# Altium schematic sheet S7CAS-PLEIADES-CARTE-MERE_P07_CLOCK.SchDoc
size Tabloid; DocumentNumber: 10; SheetNumber: 10; SheetTotal: 16; Sheet_Name: CLOCK; Size: 11x17
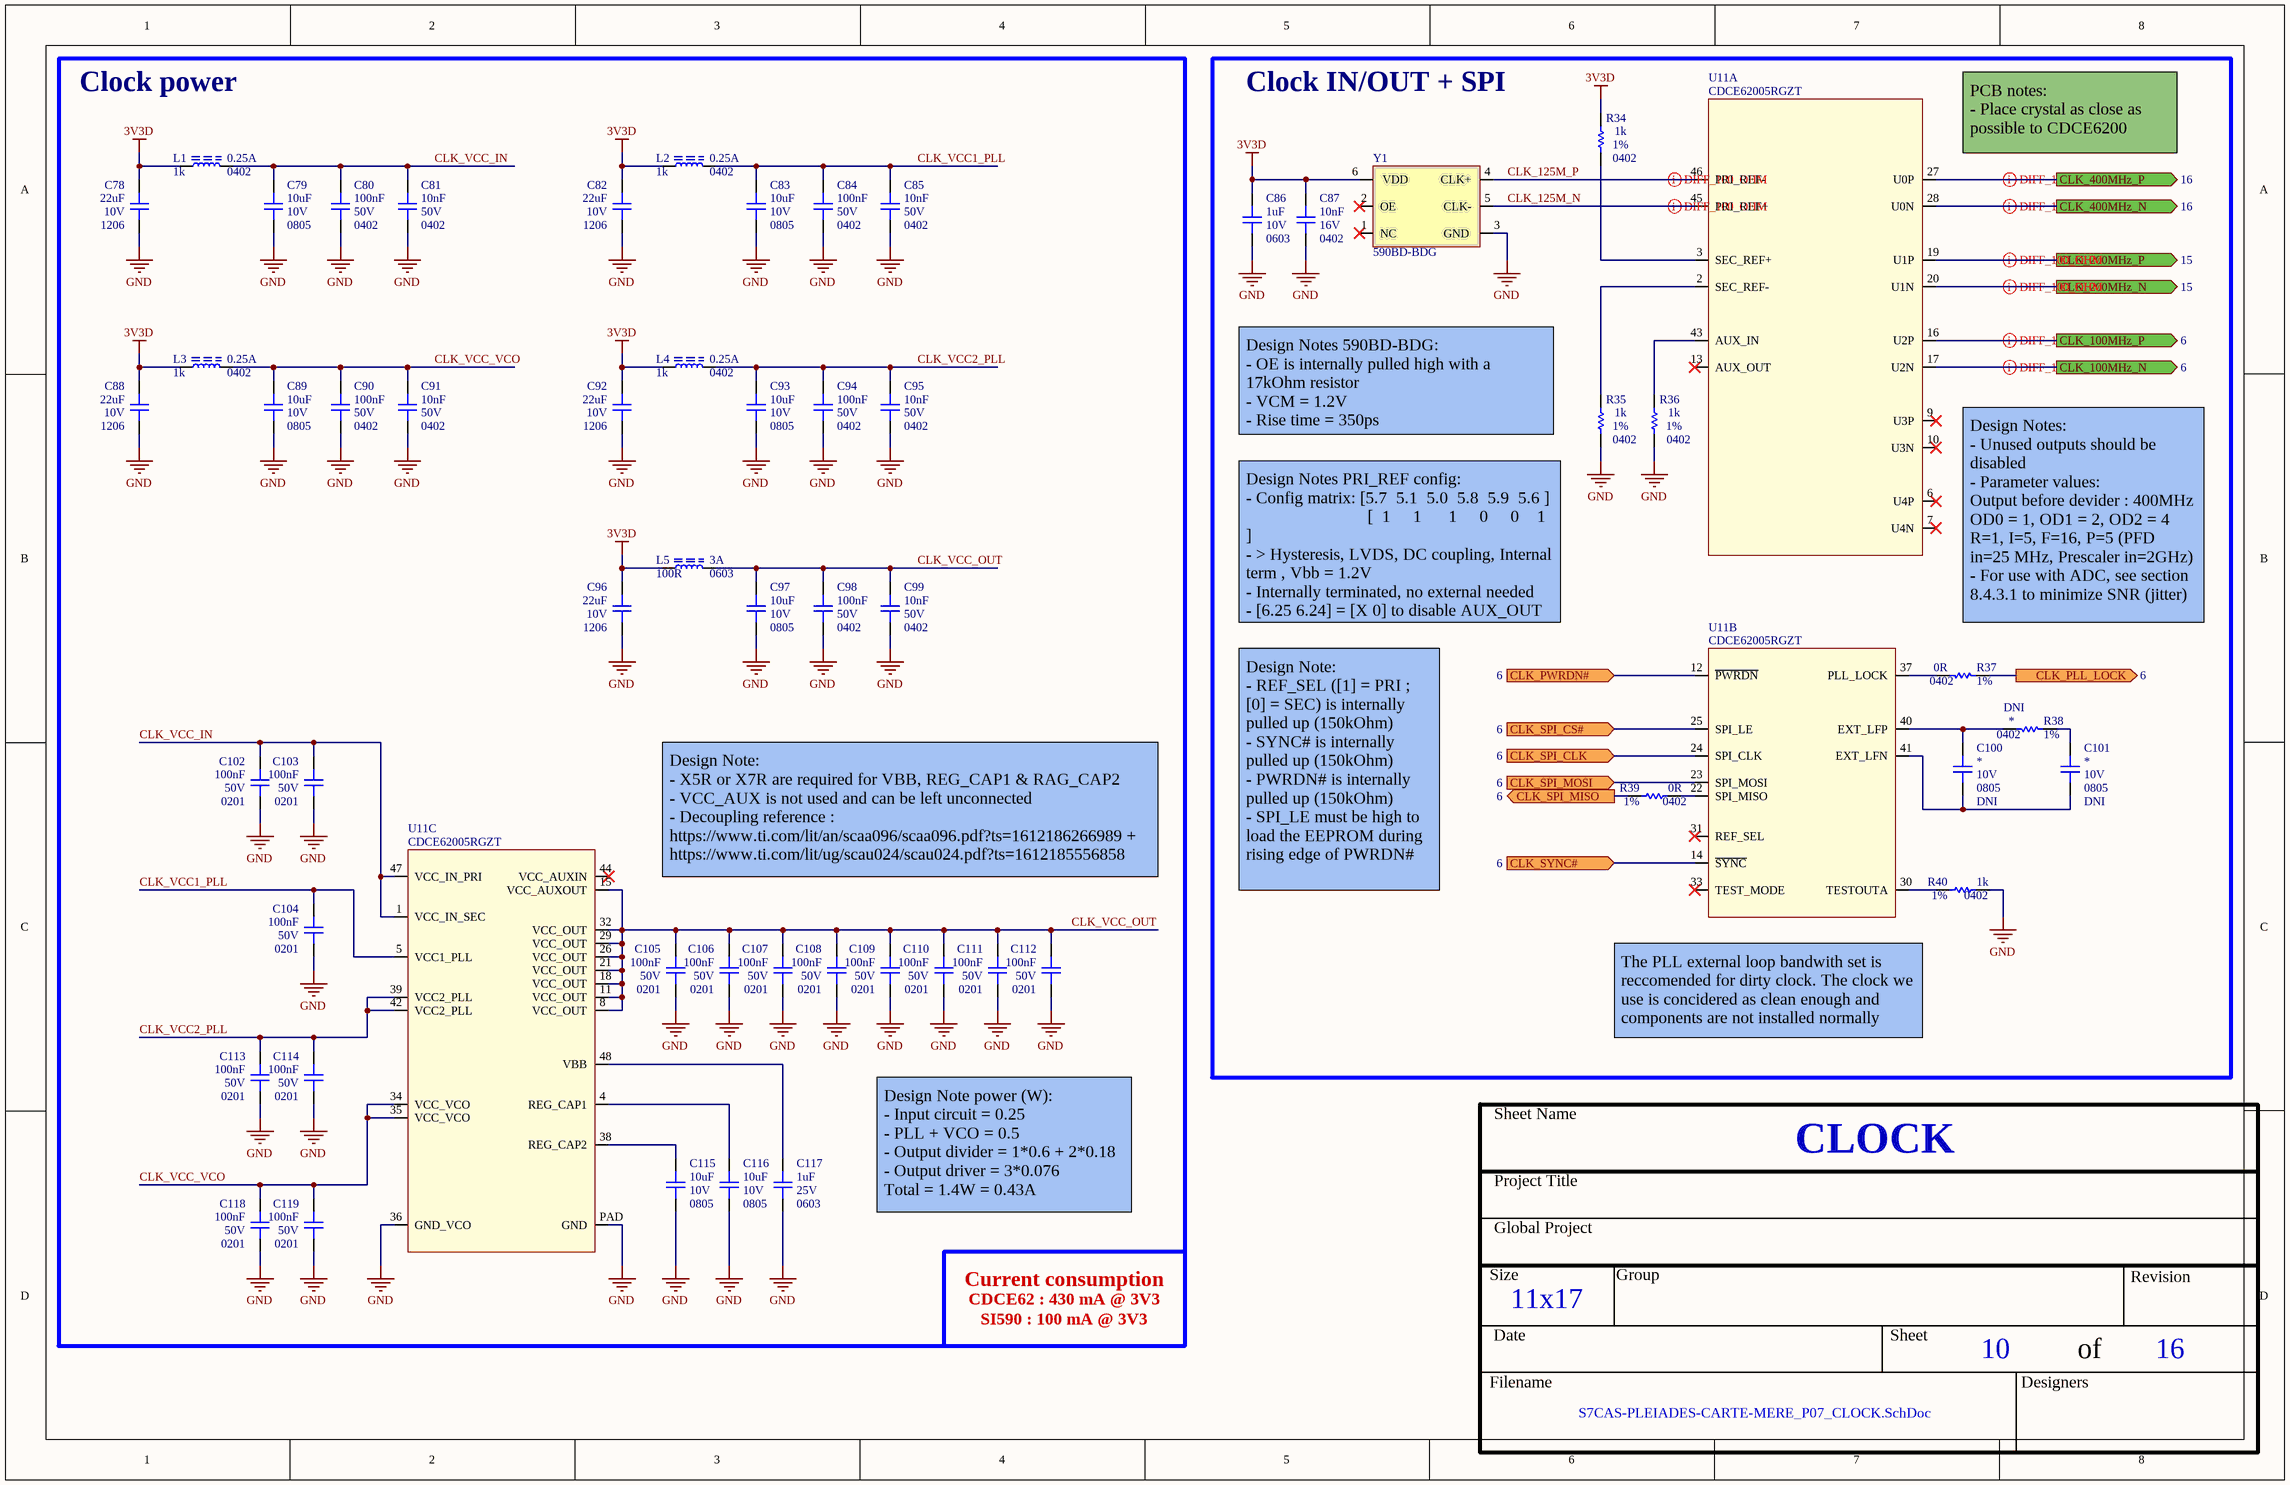
[diagram p0: S7CAS-PLEIADES-CARTE-MERE_P07_CLOCK.SchDoc]

## Parts
C78  value 22uF  Voltage: 10V  Package: 1206  [CAP_1206]  (hidden comment: CAP - 1206)
C79  value 10uF  Voltage: 10V  Package: 0805  [CAP_0805]  (hidden comment: CAP - 0805)
C80  value 100nF  Voltage: 50V  Package: 0402  [CAP_0402]  (hidden comment: CAP - 0402)
C81  value 10nF  Voltage: 50V  Package: 0402  [CAP_0402]  (hidden comment: CAP - 0402)
C82  value 22uF  Voltage: 10V  Package: 1206  [CAP_1206]  (hidden comment: CAP - 1206)
C83  value 10uF  Voltage: 10V  Package: 0805  [CAP_0805]  (hidden comment: CAP - 0805)
C84  value 100nF  Voltage: 50V  Package: 0402  [CAP_0402]  (hidden comment: CAP - 0402)
C85  value 10nF  Voltage: 50V  Package: 0402  [CAP_0402]  (hidden comment: CAP - 0402)
C86  value 1uF  Voltage: 10V  Package: 0603  [CAP_0603]  (hidden comment: CAP - 0603)
C87  value 10nF  Voltage: 16V  Package: 0402  [CAP_0402]  (hidden comment: CAP - 0402)
C88  value 22uF  Voltage: 10V  Package: 1206  [CAP_1206]  (hidden comment: CAP - 1206)
C89  value 10uF  Voltage: 10V  Package: 0805  [CAP_0805]  (hidden comment: CAP - 0805)
C90  value 100nF  Voltage: 50V  Package: 0402  [CAP_0402]  (hidden comment: CAP - 0402)
C91  value 10nF  Voltage: 50V  Package: 0402  [CAP_0402]  (hidden comment: CAP - 0402)
C92  value 22uF  Voltage: 10V  Package: 1206  [CAP_1206]  (hidden comment: CAP - 1206)
C93  value 10uF  Voltage: 10V  Package: 0805  [CAP_0805]  (hidden comment: CAP - 0805)
C94  value 100nF  Voltage: 50V  Package: 0402  [CAP_0402]  (hidden comment: CAP - 0402)
C95  value 10nF  Voltage: 50V  Package: 0402  [CAP_0402]  (hidden comment: CAP - 0402)
C96  value 22uF  Voltage: 10V  Package: 1206  [CAP_1206]  (hidden comment: CAP - 1206)
C97  value 10uF  Voltage: 10V  Package: 0805  [CAP_0805]  (hidden comment: CAP - 0805)
C98  value 100nF  Voltage: 50V  Package: 0402  [CAP_0402]  (hidden comment: CAP - 0402)
C99  value 10nF  Voltage: 50V  Package: 0402  [CAP_0402]  (hidden comment: CAP - 0402)
C100  Voltage: 10V  NI: DNI  Package: 0805  [CAP_0805]  (hidden comment: CAP - 0805)
C101  Voltage: 10V  NI: DNI  Package: 0805  [CAP_0805]  (hidden comment: CAP - 0805)
C102  value 100nF  Voltage: 50V  Package: 0201  [CAP_0201]  (hidden comment: CAP - 0201)
C103  value 100nF  Voltage: 50V  Package: 0201  [CAP_0201]  (hidden comment: CAP - 0201)
C104  value 100nF  Voltage: 50V  Package: 0201  [CAP_0201]  (hidden comment: CAP - 0201)
C105  value 100nF  Voltage: 50V  Package: 0201  [CAP_0201]  (hidden comment: CAP - 0201)
C106  value 100nF  Voltage: 50V  Package: 0201  [CAP_0201]  (hidden comment: CAP - 0201)
C107  value 100nF  Voltage: 50V  Package: 0201  [CAP_0201]  (hidden comment: CAP - 0201)
C108  value 100nF  Voltage: 50V  Package: 0201  [CAP_0201]  (hidden comment: CAP - 0201)
C109  value 100nF  Voltage: 50V  Package: 0201  [CAP_0201]  (hidden comment: CAP - 0201)
C110  value 100nF  Voltage: 50V  Package: 0201  [CAP_0201]  (hidden comment: CAP - 0201)
C111  value 100nF  Voltage: 50V  Package: 0201  [CAP_0201]  (hidden comment: CAP - 0201)
C112  value 100nF  Voltage: 50V  Package: 0201  [CAP_0201]  (hidden comment: CAP - 0201)
C113  value 100nF  Voltage: 50V  Package: 0201  [CAP_0201]  (hidden comment: CAP - 0201)
C114  value 100nF  Voltage: 50V  Package: 0201  [CAP_0201]  (hidden comment: CAP - 0201)
C115  value 10uF  Voltage: 10V  Package: 0805  [CAP_0805]  (hidden comment: CAP - 0805)
C116  value 10uF  Voltage: 10V  Package: 0805  [CAP_0805]  (hidden comment: CAP - 0805)
C117  value 1uF  Voltage: 25V  Package: 0603  [CAP_0603]  (hidden comment: CAP - 0603)
C118  value 100nF  Voltage: 50V  Package: 0201  [CAP_0201]  (hidden comment: CAP - 0201)
C119  value 100nF  Voltage: 50V  Package: 0201  [CAP_0201]  (hidden comment: CAP - 0201)
L1  value 1k  Current: 0.25A  Package: 0402  [FER_0402]  (hidden comment: FER - 0402)
L2  value 1k  Current: 0.25A  Package: 0402  [FER_0402]  (hidden comment: FER - 0402)
L3  value 1k  Current: 0.25A  Package: 0402  [FER_0402]  (hidden comment: FER - 0402)
L4  value 1k  Current: 0.25A  Package: 0402  [FER_0402]  (hidden comment: FER - 0402)
L5  value 100R  Current: 3A  Package: 0603  [FER_0603]  (hidden comment: FER - 0603)
R34  value 1k  Package: 0402  Precision: 1%  [RES_0402]  (hidden comment: RES - 0402)
R35  value 1k  Package: 0402  Precision: 1%  [RES_0402]  (hidden comment: RES - 0402)
R36  value 1k  Package: 0402  Precision: 1%  [RES_0402]  (hidden comment: RES - 0402)
R37  value 0R  Package: 0402  Precision: 1%  [RES_0402]  (hidden comment: RES - 0402)
R38  NI: DNI  Package: 0402  Precision: 1%  [RES_0402]  (hidden comment: RES - 0402)
R39  value 0R  Package: 0402  Precision: 1%  [RES_0402]  (hidden comment: RES - 0402)
R40  value 1k  Package: 0402  Precision: 1%  [RES_0402]  (hidden comment: RES - 0402)
U11  CDCE62005RGZT  [TIM_CDCE62005RGZT]  (parts A,B,C of 3)
Y1  590BD-BDG  [OSC_590BD-BDG]

## Blocks framed on the sheet
Clock power: C78-C85 C88-C99 C102-C119 L1-L5 U11
Clock IN/OUT + SPI: C86 C87 C100 C101 R34-R40 U11 Y1

## Ports
CLK_100MHz_N (out, see 6), CLK_100MHz_P (out, see 6), CLK_200MHz_N (out, see 15), CLK_200MHz_P (out, see 15), CLK_400MHz_N (out, see 16), CLK_400MHz_P (out, see 16), CLK_PLL_LOCK (out, see 6), CLK_PWRDN# (in, see 6), CLK_SPI_CLK (in, see 6), CLK_SPI_CS# (in, see 6), CLK_SPI_MISO (out, see 6), CLK_SPI_MOSI (in, see 6), CLK_SYNC# (in, see 6)

## Nets
3V3D: C78.2 C82.2 C86.2 C87.2 C88.2 C92.2 C96.2 L1.2 L2.2 L3.2 L4.2 L5.2 R34.2 Y1.6(VDD)
GND: C78.1 C79.1 C80.1 C81.1 C82.1 C83.1 C84.1 C85.1 C86.1 C87.1 C88.1 C89.1 C90.1 C91.1 C92.1 C93.1 C94.1 C95.1 C96.1 C97.1 C98.1 C99.1 C102.1 C103.1 C104.1 C105.1 C106.1 C107.1 C108.1 C109.1 C110.1 C111.1 C112.1 C113.1 C114.1 C115.1 C116.1 C117.1 C118.1 C119.1 R35.1 R36.1 R40.1 U11.36(GND_VCO) U11.PAD(GND) Y1.3(GND)
CLK_100MHz_N: U11.17(U2N) ; port CLK_100MHz_N
CLK_100MHz_P: U11.16(U2P) ; port CLK_100MHz_P
CLK_125M_N: U11.45(PRI_REF+) Y1.5(CLK-)
CLK_125M_P: U11.46(PRI_REF-) Y1.4(CLK+)
CLK_200MHz_N: U11.20(U1N) ; port CLK_200MHz_N
CLK_200MHz_P: U11.19(U1P) ; port CLK_200MHz_P
CLK_400MHz_N: U11.28(U0N) ; port CLK_400MHz_N
CLK_400MHz_P: U11.27(U0P) ; port CLK_400MHz_P
CLK_PLL_LOCK: R37.2 ; port CLK_PLL_LOCK
CLK_PWRDN#: U11.12(~{PWRDN}) ; port CLK_PWRDN#
CLK_SPI_CLK: U11.24(SPI_CLK) ; port CLK_SPI_CLK
CLK_SPI_CS#: U11.25(SPI_LE) ; port CLK_SPI_CS#
CLK_SPI_MISO: R39.2 ; port CLK_SPI_MISO
CLK_SPI_MOSI: U11.23(SPI_MOSI) ; port CLK_SPI_MOSI
CLK_SYNC#: U11.14(~{SYNC}) ; port CLK_SYNC#
CLK_VCC1_PLL: C83.2 C84.2 C85.2 C104.2 L2.1 U11.5(VCC1_PLL)
CLK_VCC2_PLL: C93.2 C94.2 C95.2 C113.2 C114.2 L4.1 U11.39(VCC2_PLL) U11.42(VCC2_PLL)
CLK_VCC_IN: C79.2 C80.2 C81.2 C102.2 C103.2 L1.1 U11.1(VCC_IN_SEC) U11.47(VCC_IN_PRI)
CLK_VCC_OUT: C97.2 C98.2 C99.2 C105.2 C106.2 C107.2 C108.2 C109.2 C110.2 C111.2 C112.2 L5.1 U11.8(VCC_OUT) U11.11(VCC_OUT) U11.15(VCC_AUXOUT) U11.18(VCC_OUT) U11.21(VCC_OUT) U11.26(VCC_OUT) U11.29(VCC_OUT) U11.32(VCC_OUT)
CLK_VCC_VCO: C89.2 C90.2 C91.2 C118.2 C119.2 L3.1 U11.34(VCC_VCO) U11.35(VCC_VCO)
NetC100_1: C100.1 C101.1 U11.41(EXT_LFN)
NetC100_2: C100.2 R38.1 U11.40(EXT_LFP)
NetC101_2: C101.2 R38.2
NetC115_2: C115.2 U11.38(REG_CAP2)
NetC116_2: C116.2 U11.4(REG_CAP1)
NetC117_2: C117.2 U11.48(VBB)
NetR34_1: R34.1 U11.3(SEC_REF+)
NetR35_2: R35.2 U11.2(SEC_REF-)
NetR36_2: R36.2 U11.43(AUX_IN)
NetR37_1: R37.1 U11.37(PLL_LOCK)
NetR39_1: R39.1 U11.22(SPI_MISO)
NetR40_2: R40.2 U11.30(TESTOUTA)

Not connected (* = marked no-connect by the designer): U11 6(U4P)* 7(U4N)* 9(U3P)* 10(U3N)* 13(AUX_OUT)* 31(REF_SEL)* 33(TEST_MODE)* 44(VCC_AUXIN)*; Y1 1(NC)* 2(OE)*

## Layout directives
differential pair; net class DIFF_100_OHM: CLK_100MHz_N, CLK_100MHz_P, CLK_125M_N, CLK_125M_P, CLK_200MHz_N, CLK_200MHz_P, CLK_400MHz_N, CLK_400MHz_P

## Notes on the sheet
- (near U11) PCB notes:
  - Place crystal as close as possible to CDCE6200
- (near R35) Design Notes 590BD-BDG:
  - OE is internally pulled high with a 17kOhm resistor
  - VCM = 1.2V
  - Rise time = 350ps
- (near R35) Design Notes PRI_REF config:
  - Config matrix: [5.7  5.1  5.0  5.8  5.9  5.6 ]
  [  1     1      1     0     0    1  ]
  - > Hysteresis, LVDS, DC coupling, Internal term , Vbb = 1.2V
  - Internally terminated, no external needed
  - [6.25 6.24] = [X 0] to disable AUX_OUT
- Design Notes:
  - Unused outputs should be disabled
  - Parameter values:
  Output before devider : 400MHz
  OD0 = 1, OD1 = 2, OD2 = 4
  R=1, I=5, F=16, P=5 (PFD in=25 MHz, Prescaler in=2GHz)
  - For use with ADC, see section 8.4.3.1 to minimize SNR (jitter)
- Design Note:
  - X5R or X7R are required for VBB, REG_CAP1 & RAG_CAP2
  - VCC_AUX is not used and can be left unconnected
  - Decoupling reference : https://www.ti.com/lit/an/scaa096/scaa096.pdf?ts=1612186266989 + https://www.ti.com/lit/ug/scau024/scau024.pdf?ts=1612185556858
- Design Note:
  - REF_SEL ([1] = PRI ; [0] = SEC) is internally pulled up (150kOhm)
  - SYNC# is internally pulled up (150kOhm)
  - PWRDN# is internally pulled up (150kOhm)
  - SPI_LE must be high to load the EEPROM during rising edge of PWRDN#
- The PLL external loop bandwith set is reccomended for dirty clock. The clock we use is concidered as clean enough and components are not installed normally
- Design Note power (W):
  - Input circuit = 0.25
  - PLL + VCO = 0.5
  - Output divider = 1*0.6 + 2*0.18
  - Output driver = 3*0.076
  Total = 1.4W = 0.43A
- CDCE62 : 430 mA @ 3V3
- Current consumption
- SI590 : 100 mA @ 3V3
- Sheet Name
- Project Title
- Global Project
- Size
- Group
- Revision
- Date
- Sheet
- of
- Filename
- Designers

## Library data of the parts
C78 C82 C88 C92 C96 = CAP - 1206: Precision: 10%; Current: *; CreatedBy: Jonathan Bouchard; Power: *
C79 C83 C89 C93 C97 C100 C101 C115 C116 = CAP - 0805: Mfg: CL21B106KPQNNNE; Precision: 10%; Current: *; CreatedBy: Jonathan Bouchard; Power: *
  C100 C101: Value: *
C80 C81 C84 C85 C87 C90 C91 C94 C95 C98 C99 = CAP - 0402: Precision: 10%; Current: *; CreatedBy: Jonathan Bouchard; Power: *
C86 = CAP - 0603: Precision: 10%; Current: *; CreatedBy: Jonathan Bouchard; Power: *
C102-C114 C118 C119 = CAP - 0201: Precision: 10%; Current: *; CreatedBy: Jonathan Bouchard; Power: *
C117 = CAP - 0603: Mfg Part Number: CC0603KRX5R8BB105; Precision: 10%; Current: *; CreatedBy: Jonathan Bouchard; Power: *
L1-L4 = FER - 0402: Mfg Part Number: BLM15HD102SN1D; Voltage: *; CreatedBy: Jonathan Bouchard; Power: *; Precision: *
L5 = FER - 0603: Mfg Part Number: BLM18KG101TN1D; Voltage: *; CreatedBy: Jonathan Bouchard; Power: *; Precision: *
R34-R40 = RES - 0402: Voltage: 50V; Power: 1/16W; Current: *; CreatedBy: Jonathan Bouchard
  R38: Value: *
U11 = TIM_CDCE62005RGZT: TIM - CLK SYNTH JITTER CLEANER 3:5 - QFN-48; Voltage: 3 V ~ 3.6 V; Mfg: Texas Instruments; Current: *; Power: *; Mfg Part Number: CDCE62005RGZT; HelpURL: http://www.ti.com/lit/ds/symlink/cdce62005.pdf; CreatedBy: Jonathan Bouchard; Temperature: -40°C ~ 85°C; Value: *; Precision: *; Package: QFN-48; Supplier 1: Digikey; Supplier Part Number 1: 296-23947-1-ND
Y1 = OSC_590BD-BDG: TIM - OSC PROG 125MHz ~ 214.999MHz LVDS 3.3V 7PPM EN/DS - 6-SMD; Manufacturer #1: Silicon Labs; Current Rating: 100 mA (supply); Note: Spécifié la fréquence lors de la commande; Voltage rating: 3.3V (supply); Polarized: Yes; Value: ±7ppm (freq Stability), ±20ppm (freq stability total); Magnetic Material: UNKNOWN; GRAMS Lib Spec: 2.8; Manufacturer #2: *; Power Max: *; Part Number #1: 590BD-BDG; Part Number #2: *; HelpURL: https://www.silabs.com/documents/public/data-sheets/Si590-591.pdf; Supplier 1: Digi-Key; Supplier Part Number 1: 590BD-BDG-ND; Assembly Type: SMD; Temperature: -40°C ~ 85°C; Package: 6-SMD; CreatedBy/Date: from 590BD-CDG; Tolerance: *; VerifiedBy: Caroline Paulin / 3/10/2019; Cryo: UNKNOWN